# Altium schematic sheet typeCounter.SchDoc
size 594 x 420 mm; SheetNumber: 10; SheetTotal: 11; SPICEModelCacheTYHCYEQT: <root> / <DocumentId>TYHCYEQT</DocumentId> / <CacheFrame Number="0"> / <Model Name="0603_885012206095_100nf" Kind="CKT"> / <Text>******* / .subckt 0603_885012206095_100nF 1 2 / Rser 1 3 0.0157659152881 / Lser 2 4 3.10171966E-10 / C1 3 4 0.0000001 / Rpar 3 4 5000000000 / .ends 0603_885012206095_100nF</Text> / </Model> / <Model Name="0603_885012106006_10uf" Kind="CKT"> / <Text>******* / .subckt 0603_885012106006_10uF 1 2 / Rser 1 3 0.00407641026021 / Lser 2 4 4.16060333E-10 / C1 3 4 0.00001 / Rpar 3 4 5000000 / .ends 0603_885012106006_10uF</Text> / </Model> / </CacheFrame> / </root>
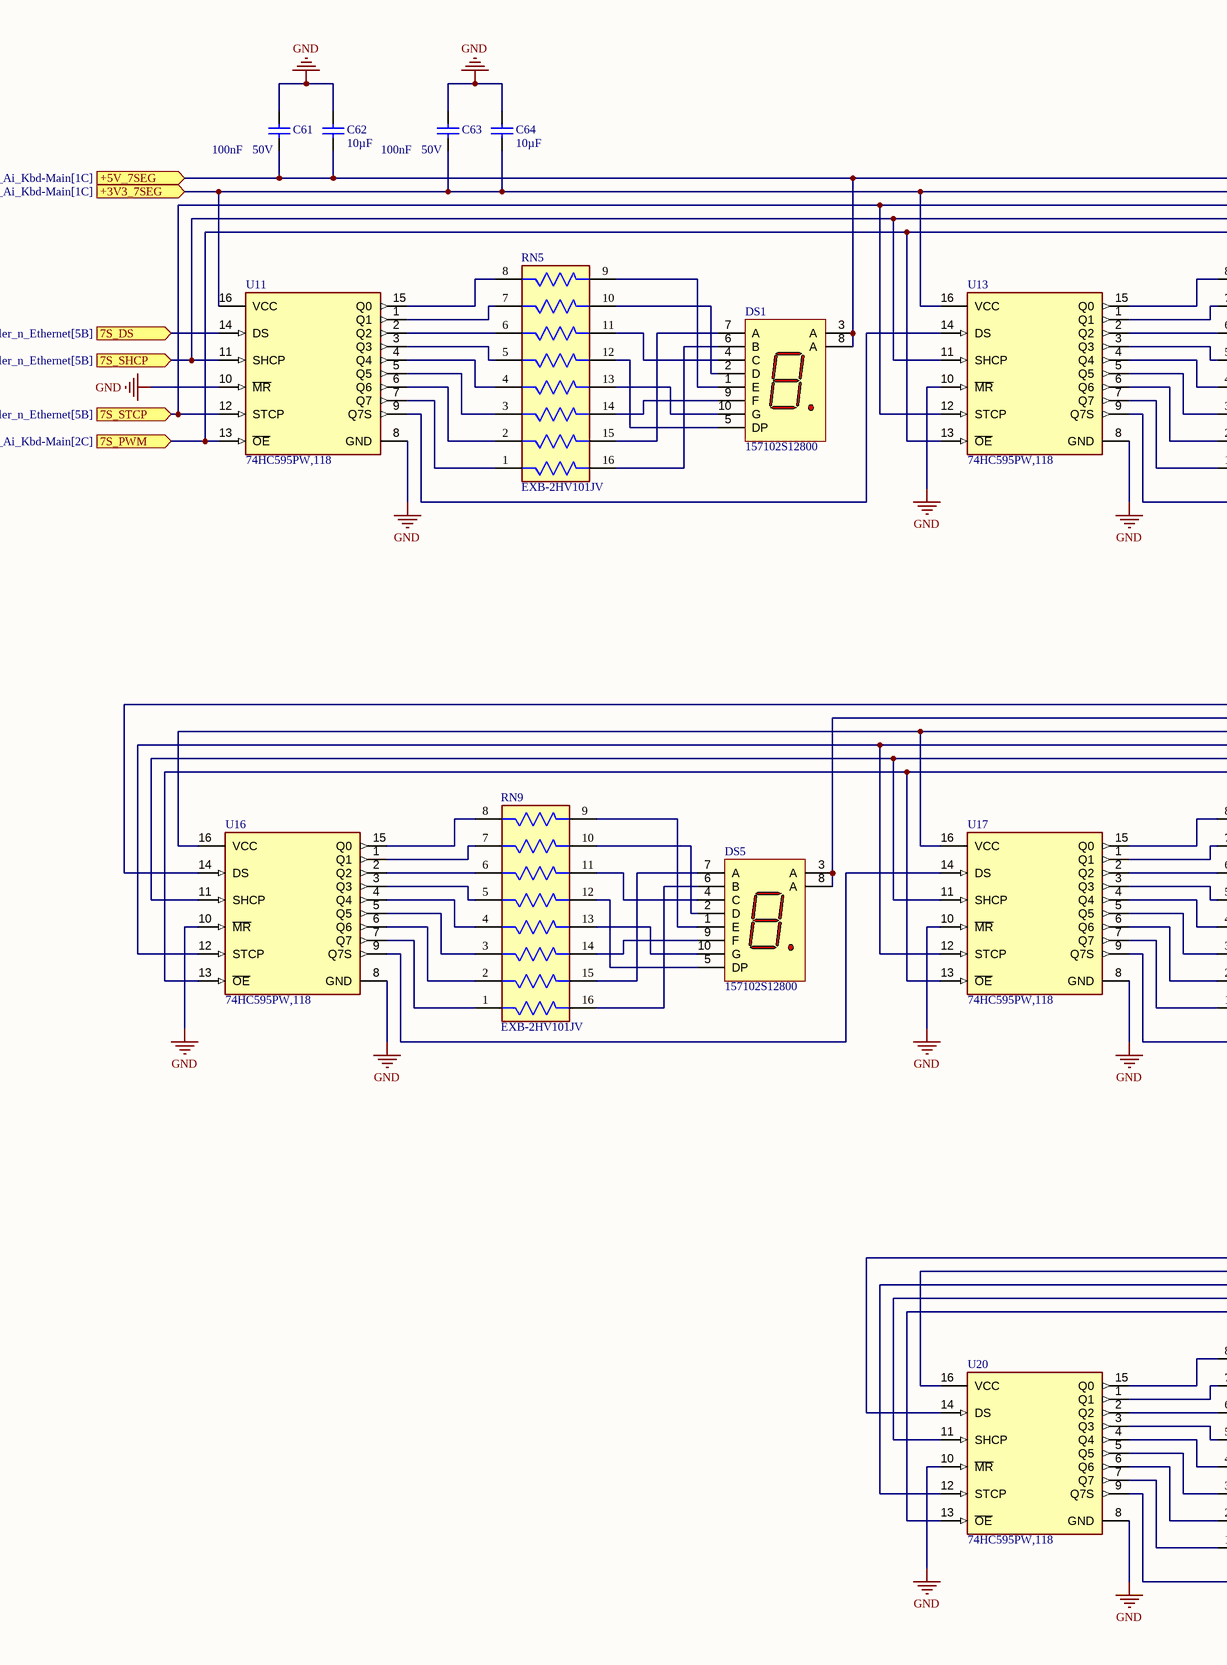
[diagram p0: typeCounter.SchDoc, left]
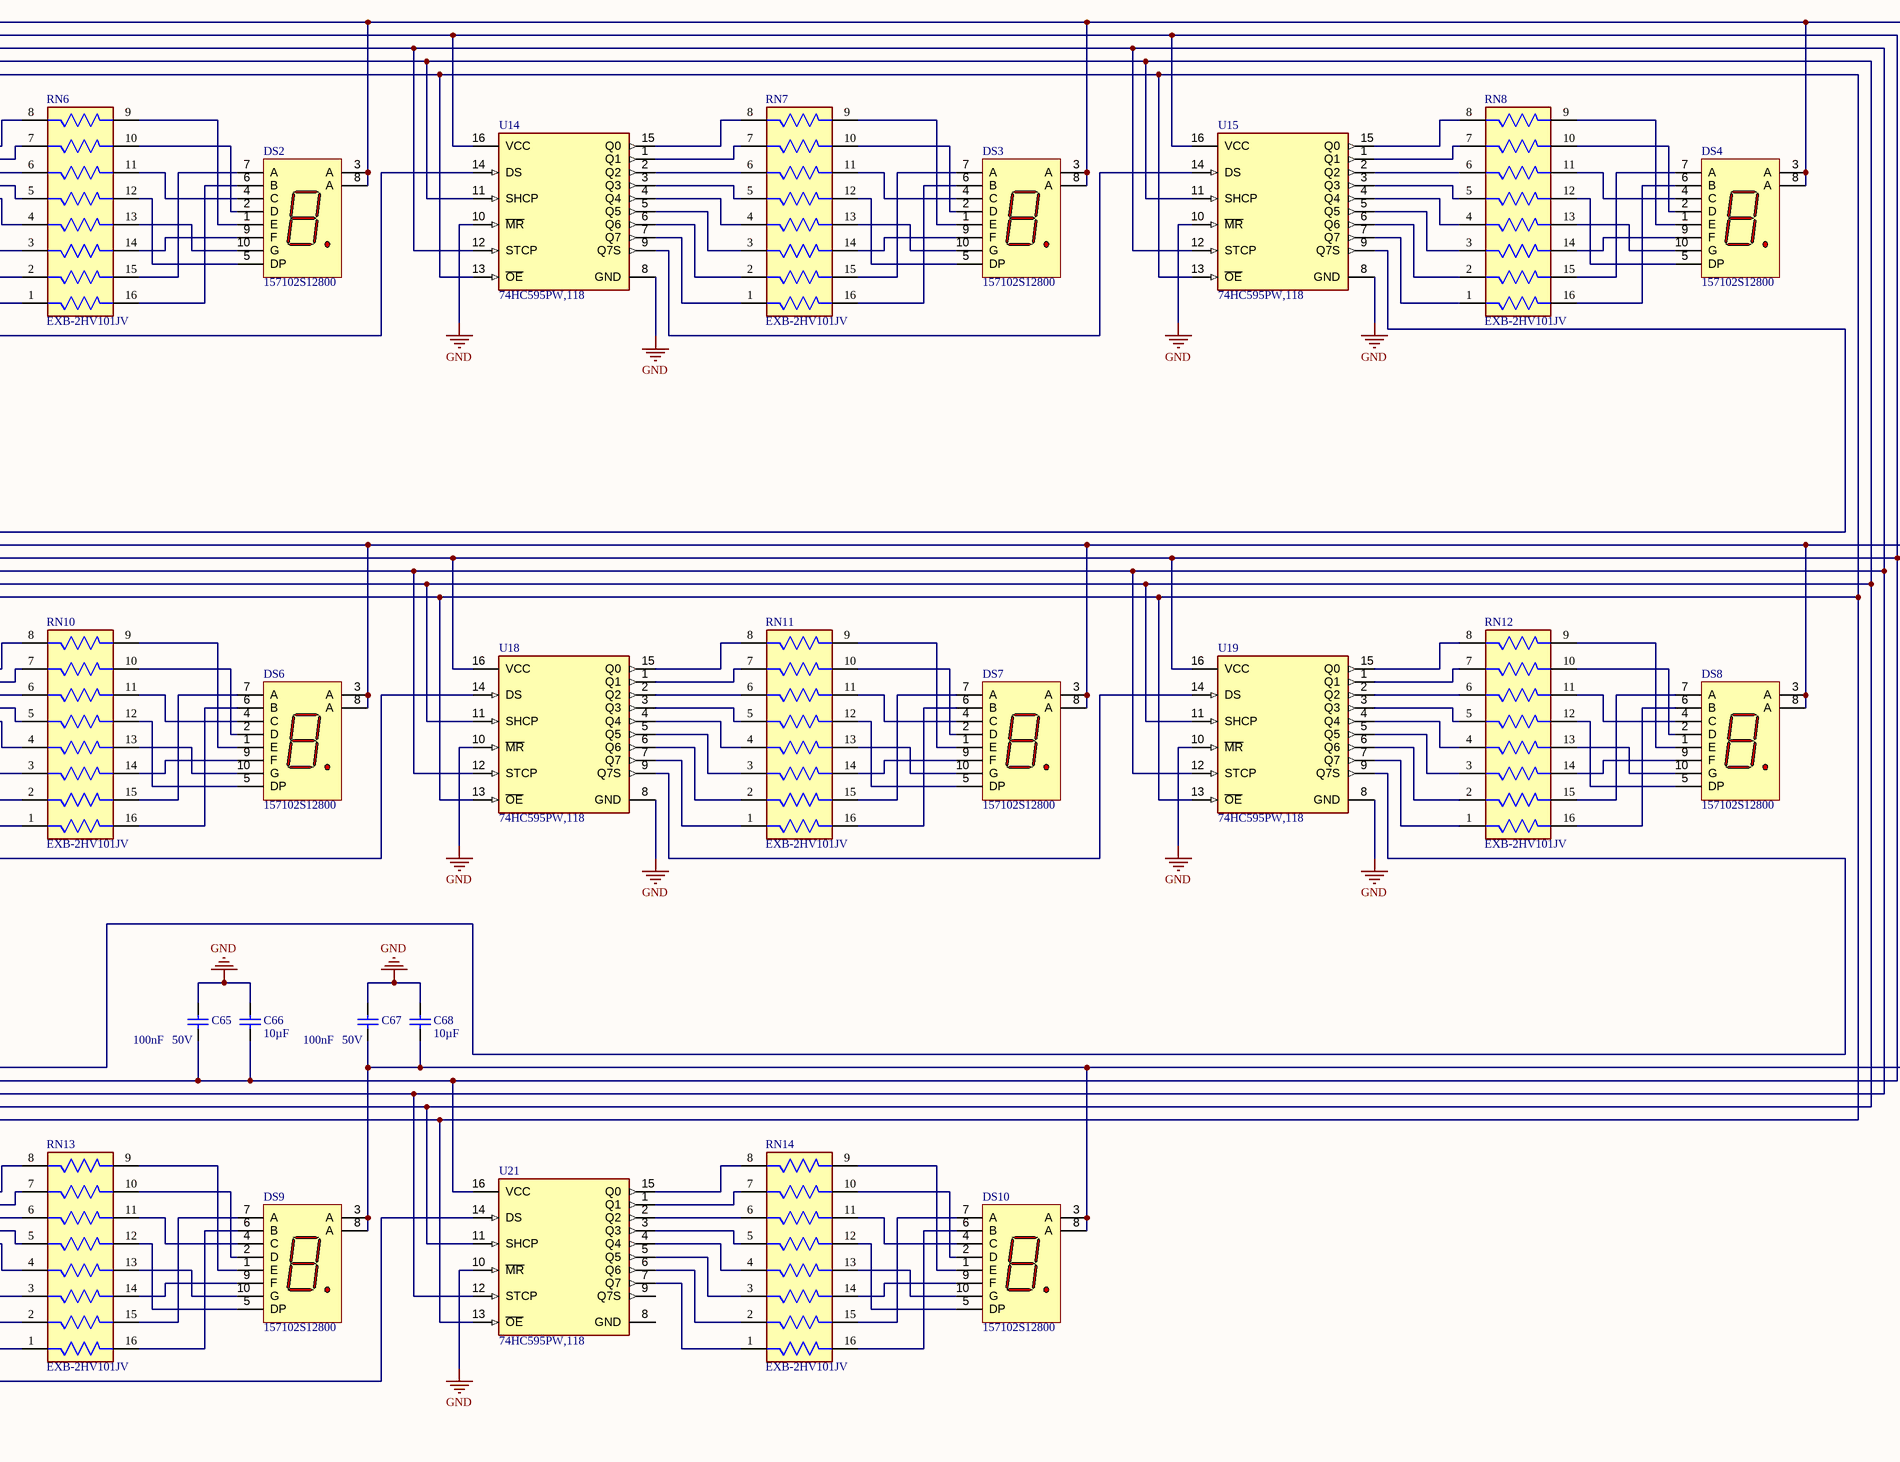
[diagram p1: typeCounter.SchDoc, right]

## Parts
C61  Capacitance: 100nF  Rated Voltage (DC): 50V  [WCAP-CSGP_0603_L1.6W0.8H0.8_Reflow]  (hidden comment: 885012206095)
C62  Capacitance: 10µF  [WCAP-CSGP_0603_L1.6W0.8H0.8_Reflow]  (hidden comment: 885012106006)
C63  Capacitance: 100nF  Rated Voltage (DC): 50V  [WCAP-CSGP_0603_L1.6W0.8H0.8_Reflow]  (hidden comment: 885012206095)
C64  Capacitance: 10µF  [WCAP-CSGP_0603_L1.6W0.8H0.8_Reflow]  (hidden comment: 885012106006)
C65  Capacitance: 100nF  Rated Voltage (DC): 50V  [WCAP-CSGP_0603_L1.6W0.8H0.8_Reflow]  (hidden comment: 885012206095)
C66  Capacitance: 10µF  [WCAP-CSGP_0603_L1.6W0.8H0.8_Reflow]  (hidden comment: 885012106006)
C67  Capacitance: 100nF  Rated Voltage (DC): 50V  [WCAP-CSGP_0603_L1.6W0.8H0.8_Reflow]  (hidden comment: 885012206095)
C68  Capacitance: 10µF  [WCAP-CSGP_0603_L1.6W0.8H0.8_Reflow]  (hidden comment: 885012106006)
DS1  157102S12800  [WL-S7DS_L10W6.9H3]
DS2  157102S12800  [WL-S7DS_L10W6.9H3]
DS3  157102S12800  [WL-S7DS_L10W6.9H3]
DS4  157102S12800  [WL-S7DS_L10W6.9H3]
DS5  157102S12800  [WL-S7DS_L10W6.9H3]
DS6  157102S12800  [WL-S7DS_L10W6.9H3]
DS7  157102S12800  [WL-S7DS_L10W6.9H3]
DS8  157102S12800  [WL-S7DS_L10W6.9H3]
DS9  157102S12800  [WL-S7DS_L10W6.9H3]
DS10  157102S12800  [WL-S7DS_L10W6.9H3]
RN5  EXB-2HV101JV  [FP-EXB2HV-MFG]
RN6  EXB-2HV101JV  [FP-EXB2HV-MFG]
RN7  EXB-2HV101JV  [FP-EXB2HV-MFG]
RN8  EXB-2HV101JV  [FP-EXB2HV-MFG]
RN9  EXB-2HV101JV  [FP-EXB2HV-MFG]
RN10  EXB-2HV101JV  [FP-EXB2HV-MFG]
RN11  EXB-2HV101JV  [FP-EXB2HV-MFG]
RN12  EXB-2HV101JV  [FP-EXB2HV-MFG]
RN13  EXB-2HV101JV  [FP-EXB2HV-MFG]
RN14  EXB-2HV101JV  [FP-EXB2HV-MFG]
U11  74HC595PW,118  [FP-SOT403-1-MFG]
U13  74HC595PW,118  [FP-SOT403-1-MFG]
U14  74HC595PW,118  [FP-SOT403-1-MFG]
U15  74HC595PW,118  [FP-SOT403-1-MFG]
U16  74HC595PW,118  [FP-SOT403-1-MFG]
U17  74HC595PW,118  [FP-SOT403-1-MFG]
U18  74HC595PW,118  [FP-SOT403-1-MFG]
U19  74HC595PW,118  [FP-SOT403-1-MFG]
U20  74HC595PW,118  [FP-SOT403-1-MFG]
U21  74HC595PW,118  [FP-SOT403-1-MFG]

## Ports
7S_DS (in, see Gen_Ai_Kbd-Main[2C], uController_n_Ethernet[5B]), 7S_PWM (in, see Gen_Ai_Kbd-Main[2C]), 7S_SHCP (in, see Gen_Ai_Kbd-Main[2C], uController_n_Ethernet[5B]), 7S_STCP (in, see Gen_Ai_Kbd-Main[2C], uController_n_Ethernet[5B]), +3V3_7SEG (in, see Gen_Ai_Kbd-Main[1C]), +5V_7SEG (in, see Gen_Ai_Kbd-Main[1C])

## Nets
GND: C61.2 C62.2 C63.2 C64.2 C65.2 C66.2 C67.2 C68.2 U11.8(GND) U11.10(~{MR}) U13.8(GND) U13.10(~{MR}) U14.8(GND) U14.10(~{MR}) U15.8(GND) U15.10(~{MR}) U16.8(GND) U16.10(~{MR}) U17.8(GND) U17.10(~{MR}) U18.8(GND) U18.10(~{MR}) U19.8(GND) U19.10(~{MR}) U20.8(GND) U20.10(~{MR}) U21.10(~{MR})
7S_DS: U11.14(DS) ; port 7S_DS
7S_PWM: U11.13(~{OE}) U13.13(~{OE}) U14.13(~{OE}) U15.13(~{OE}) U16.13(~{OE}) U17.13(~{OE}) U18.13(~{OE}) U19.13(~{OE}) U20.13(~{OE}) U21.13(~{OE}) ; port 7S_PWM
7S_SHCP: U11.11(SHCP) U13.11(SHCP) U14.11(SHCP) U15.11(SHCP) U16.11(SHCP) U17.11(SHCP) U18.11(SHCP) U19.11(SHCP) U20.11(SHCP) U21.11(SHCP) ; port 7S_SHCP
7S_STCP: U11.12(STCP) U13.12(STCP) U14.12(STCP) U15.12(STCP) U16.12(STCP) U17.12(STCP) U18.12(STCP) U19.12(STCP) U20.12(STCP) U21.12(STCP) ; port 7S_STCP
+3V3_7SEG: C63.1 C64.1 C65.1 C66.1 U11.16(VCC) U13.16(VCC) U14.16(VCC) U15.16(VCC) U16.16(VCC) U17.16(VCC) U18.16(VCC) U19.16(VCC) U20.16(VCC) U21.16(VCC) ; port +3V3_7SEG
+5V_7SEG: C61.1 C62.1 C67.1 C68.1 DS1.3(A) DS1.8(A) DS2.3(A) DS2.8(A) DS3.3(A) DS3.8(A) DS4.3(A) DS4.8(A) DS5.3(A) DS5.8(A) DS6.3(A) DS6.8(A) DS7.3(A) DS7.8(A) DS8.3(A) DS8.8(A) DS9.3(A) DS9.8(A) DS10.3(A) DS10.8(A) ; port +5V_7SEG
NetDS1_1: DS1.1(E) RN5.9
NetDS1_2: DS1.2(D) RN5.10
NetDS1_4: DS1.4(C) RN5.11
NetDS1_5: DS1.5(DP) RN5.12
NetDS1_6: DS1.6(B) RN5.16
NetDS1_7: DS1.7(A) RN5.15
NetDS1_9: DS1.9(F) RN5.14
NetDS1_10: DS1.10(G) RN5.13
NetDS2_1: DS2.1(E) RN6.9
NetDS2_2: DS2.2(D) RN6.10
NetDS2_4: DS2.4(C) RN6.11
NetDS2_5: DS2.5(DP) RN6.12
NetDS2_6: DS2.6(B) RN6.16
NetDS2_7: DS2.7(A) RN6.15
NetDS2_9: DS2.9(F) RN6.14
NetDS2_10: DS2.10(G) RN6.13
NetDS3_1: DS3.1(E) RN7.9
NetDS3_2: DS3.2(D) RN7.10
NetDS3_4: DS3.4(C) RN7.11
NetDS3_5: DS3.5(DP) RN7.12
NetDS3_6: DS3.6(B) RN7.16
NetDS3_7: DS3.7(A) RN7.15
NetDS3_9: DS3.9(F) RN7.14
NetDS3_10: DS3.10(G) RN7.13
NetDS4_1: DS4.1(E) RN8.9
NetDS4_2: DS4.2(D) RN8.10
NetDS4_4: DS4.4(C) RN8.11
NetDS4_5: DS4.5(DP) RN8.12
NetDS4_6: DS4.6(B) RN8.16
NetDS4_7: DS4.7(A) RN8.15
NetDS4_9: DS4.9(F) RN8.14
NetDS4_10: DS4.10(G) RN8.13
NetDS5_1: DS5.1(E) RN9.9
NetDS5_2: DS5.2(D) RN9.10
NetDS5_4: DS5.4(C) RN9.11
NetDS5_5: DS5.5(DP) RN9.12
NetDS5_6: DS5.6(B) RN9.16
NetDS5_7: DS5.7(A) RN9.15
NetDS5_9: DS5.9(F) RN9.14
NetDS5_10: DS5.10(G) RN9.13
NetDS6_1: DS6.1(E) RN10.9
NetDS6_2: DS6.2(D) RN10.10
NetDS6_4: DS6.4(C) RN10.11
NetDS6_5: DS6.5(DP) RN10.12
NetDS6_6: DS6.6(B) RN10.16
NetDS6_7: DS6.7(A) RN10.15
NetDS6_9: DS6.9(F) RN10.14
NetDS6_10: DS6.10(G) RN10.13
NetDS7_1: DS7.1(E) RN11.9
NetDS7_2: DS7.2(D) RN11.10
NetDS7_4: DS7.4(C) RN11.11
NetDS7_5: DS7.5(DP) RN11.12
NetDS7_6: DS7.6(B) RN11.16
NetDS7_7: DS7.7(A) RN11.15
NetDS7_9: DS7.9(F) RN11.14
NetDS7_10: DS7.10(G) RN11.13
NetDS8_1: DS8.1(E) RN12.9
NetDS8_2: DS8.2(D) RN12.10
NetDS8_4: DS8.4(C) RN12.11
NetDS8_5: DS8.5(DP) RN12.12
NetDS8_6: DS8.6(B) RN12.16
NetDS8_7: DS8.7(A) RN12.15
NetDS8_9: DS8.9(F) RN12.14
NetDS8_10: DS8.10(G) RN12.13
NetDS9_1: DS9.1(E) RN13.9
NetDS9_2: DS9.2(D) RN13.10
NetDS9_4: DS9.4(C) RN13.11
NetDS9_5: DS9.5(DP) RN13.12
NetDS9_6: DS9.6(B) RN13.16
NetDS9_7: DS9.7(A) RN13.15
NetDS9_9: DS9.9(F) RN13.14
NetDS9_10: DS9.10(G) RN13.13
NetDS10_1: DS10.1(E) RN14.9
NetDS10_2: DS10.2(D) RN14.10
NetDS10_4: DS10.4(C) RN14.11
NetDS10_5: DS10.5(DP) RN14.12
NetDS10_6: DS10.6(B) RN14.16
NetDS10_7: DS10.7(A) RN14.15
NetDS10_9: DS10.9(F) RN14.14
NetDS10_10: DS10.10(G) RN14.13
NetRN5_1: RN5.1 U11.7(Q7)
NetRN5_2: RN5.2 U11.6(Q6)
NetRN5_3: RN5.3 U11.5(Q5)
NetRN5_4: RN5.4 U11.4(Q4)
NetRN5_5: RN5.5 U11.3(Q3)
NetRN5_6: RN5.6 U11.2(Q2)
NetRN5_7: RN5.7 U11.1(Q1)
NetRN5_8: RN5.8 U11.15(Q0)
NetRN6_1: RN6.1 U13.7(Q7)
NetRN6_2: RN6.2 U13.6(Q6)
NetRN6_3: RN6.3 U13.5(Q5)
NetRN6_4: RN6.4 U13.4(Q4)
NetRN6_5: RN6.5 U13.3(Q3)
NetRN6_6: RN6.6 U13.2(Q2)
NetRN6_7: RN6.7 U13.1(Q1)
NetRN6_8: RN6.8 U13.15(Q0)
NetRN7_1: RN7.1 U14.7(Q7)
NetRN7_2: RN7.2 U14.6(Q6)
NetRN7_3: RN7.3 U14.5(Q5)
NetRN7_4: RN7.4 U14.4(Q4)
NetRN7_5: RN7.5 U14.3(Q3)
NetRN7_6: RN7.6 U14.2(Q2)
NetRN7_7: RN7.7 U14.1(Q1)
NetRN7_8: RN7.8 U14.15(Q0)
NetRN8_1: RN8.1 U15.7(Q7)
NetRN8_2: RN8.2 U15.6(Q6)
NetRN8_3: RN8.3 U15.5(Q5)
NetRN8_4: RN8.4 U15.4(Q4)
NetRN8_5: RN8.5 U15.3(Q3)
NetRN8_6: RN8.6 U15.2(Q2)
NetRN8_7: RN8.7 U15.1(Q1)
NetRN8_8: RN8.8 U15.15(Q0)
NetRN9_1: RN9.1 U16.7(Q7)
NetRN9_2: RN9.2 U16.6(Q6)
NetRN9_3: RN9.3 U16.5(Q5)
NetRN9_4: RN9.4 U16.4(Q4)
NetRN9_5: RN9.5 U16.3(Q3)
NetRN9_6: RN9.6 U16.2(Q2)
NetRN9_7: RN9.7 U16.1(Q1)
NetRN9_8: RN9.8 U16.15(Q0)
NetRN10_1: RN10.1 U17.7(Q7)
NetRN10_2: RN10.2 U17.6(Q6)
NetRN10_3: RN10.3 U17.5(Q5)
NetRN10_4: RN10.4 U17.4(Q4)
NetRN10_5: RN10.5 U17.3(Q3)
NetRN10_6: RN10.6 U17.2(Q2)
NetRN10_7: RN10.7 U17.1(Q1)
NetRN10_8: RN10.8 U17.15(Q0)
NetRN11_1: RN11.1 U18.7(Q7)
NetRN11_2: RN11.2 U18.6(Q6)
NetRN11_3: RN11.3 U18.5(Q5)
NetRN11_4: RN11.4 U18.4(Q4)
NetRN11_5: RN11.5 U18.3(Q3)
NetRN11_6: RN11.6 U18.2(Q2)
NetRN11_7: RN11.7 U18.1(Q1)
NetRN11_8: RN11.8 U18.15(Q0)
NetRN12_1: RN12.1 U19.7(Q7)
NetRN12_2: RN12.2 U19.6(Q6)
NetRN12_3: RN12.3 U19.5(Q5)
NetRN12_4: RN12.4 U19.4(Q4)
NetRN12_5: RN12.5 U19.3(Q3)
NetRN12_6: RN12.6 U19.2(Q2)
NetRN12_7: RN12.7 U19.1(Q1)
NetRN12_8: RN12.8 U19.15(Q0)
NetRN13_1: RN13.1 U20.7(Q7)
NetRN13_2: RN13.2 U20.6(Q6)
NetRN13_3: RN13.3 U20.5(Q5)
NetRN13_4: RN13.4 U20.4(Q4)
NetRN13_5: RN13.5 U20.3(Q3)
NetRN13_6: RN13.6 U20.2(Q2)
NetRN13_7: RN13.7 U20.1(Q1)
NetRN13_8: RN13.8 U20.15(Q0)
NetRN14_1: RN14.1 U21.7(Q7)
NetRN14_2: RN14.2 U21.6(Q6)
NetRN14_3: RN14.3 U21.5(Q5)
NetRN14_4: RN14.4 U21.4(Q4)
NetRN14_5: RN14.5 U21.3(Q3)
NetRN14_6: RN14.6 U21.2(Q2)
NetRN14_7: RN14.7 U21.1(Q1)
NetRN14_8: RN14.8 U21.15(Q0)
NetU11_9: U11.9(Q7S) U13.14(DS)
NetU13_9: U13.9(Q7S) U14.14(DS)
NetU14_9: U14.9(Q7S) U15.14(DS)
NetU15_9: U15.9(Q7S) U16.14(DS)
NetU16_9: U16.9(Q7S) U17.14(DS)
NetU17_9: U17.9(Q7S) U18.14(DS)
NetU18_9: U18.9(Q7S) U19.14(DS)
NetU19_9: U19.9(Q7S) U20.14(DS)
NetU20_9: U20.9(Q7S) U21.14(DS)

Not connected (* = marked no-connect by the designer): U21 8(GND) 9(Q7S)

## Notes on the sheet
- DWG NO:
- REV:
- REVISION
- DESCRIPTION
- DATE
- APPROVED
- PROJECT
- sumasta
- t
- PROJECT REVISION:
- TITLE
- DOCUMENT REVISION:
- DESIGN ITEM:
- SCALE:
- A2
- SIZE
- CAGE CODE
- FILE NAME
- DWG NO.
- SHEET
- OF
- REV

## Library data of the parts
C61 C63 C65 C67 = CMP-007-000655-1: WCAP-CSGP Multilayer Ceramic Chip Capacitor, General Purpose, size 0603, X7R, 100nF, 50VDC; Manufacturer: Wurth Elektronik; Capacitance Tolerance: +/-10%; Insulation Resistance: 5GO; Case/Size Code: 0603; Technical Reference: X7R0603104K050DFCT10000; Dissipation Factor: 3%; Operating Temperature Max: 125°C; Category: Multilayer Ceramic Chip Capacitors; ComponentLink1Description: Website Link; Manufacturer Part Number: 885012206095; Pin Count: 2; Ceramic Type: X7R; Component Type: Standard; Mount: Surface Mount; Operating Temperature Min: -55°C; Source: WCAP-CSGP.SchLib; ComponentLink2URL: https://www.we-online.com/redexpert/spec/885012206095?ad; Packaging: Tape and Reel; Match Code: WCAP-CSGP; Width: 0.8mm; ComponentLink1URL: https://www.we-online.com/redexpert/article/885012206095?ad; Height: 0.8mm; Design Item ID: 885012206095; Length: 1.6mm; ComponentLink2Description: Datasheet Link
C62 C64 C66 C68 = CMP-007-000403-1: WCAP-CSGP Multilayer Ceramic Chip Capacitor, General Purpose, size 0603, X5R, 10µF, 6.3VDC; Manufacturer: Wurth Elektronik; Rated Voltage (DC): 6.3V; Insulation Resistance: 0.01GO; Technical Reference: X5R0603106M6R3DFCT10000; Dissipation Factor: 10%; Case/Size Code: 0603; Capacitance Tolerance: +/-20%; Mount: Surface Mount; Packaging: Tape and Reel; ComponentLink1URL: https://www.we-online.com/redexpert/article/885012106006?ad; Height: 0.8mm; ComponentLink2URL: https://www.we-online.com/redexpert/spec/885012106006?ad; Category: Multilayer Ceramic Chip Capacitors; Operating Temperature Max: 85°C; Operating Temperature Min: -55°C; Source: WCAP-CSGP.SchLib; Match Code: WCAP-CSGP; Design Item ID: 885012106006; Ceramic Type: X5R; Manufacturer Part Number: 885012106006; Component Type: Standard; Pin Count: 2; Width: 0.8mm; ComponentLink2Description: Datasheet Link; ComponentLink1Description: Website Link; Length: 1.6mm
DS1-DS10 = CMP-03913-133884679-1: 157102S12800 WL-S7DS 7 Segments Display SMT Single Digit; Luminous Intensity: 10mcd; Forward Current: 100mA; Max Reverse Voltage (DC): 5V; Dominant Wavelength: 635nm; Forward Voltage: 2V; RoHS: Compliant; Width: 6.9mm; Max Operating Temperature: 85°C; Length: 10mm; Min Operating Temperature: -35°C; NexarPartId: 133884679; Height: 3mm
RN5-RN14 = CMP-05421-000005-1: RES ARRAY 8 RES 100 OHM 1506; Temperature Coefficient: 200ppm/°C; Number of Contacts: 16; Power Per Element: 62.5mW; Power Rating: 250mW; Resistance Tolerance: 5%; Circuit Type: Isolated; Number of Resistors: 8; Voltage Rating: 25V; Power Dissipation: 63mW; Resistance: 100R; Voltage Rating (DC): 50V; Case/Package: 1506; Depth: 1.6mm; Thickness: 450um; Max Operating Temperature: 125°C; Mount: Surface Mount; Case Code (Imperial): 0402; Min Operating Temperature: -55°C; Termination: Convex; Packaging: Tape and Reel; Number of Terminals/Pins: 16; Technology: THICK FILM; Lead Free: Lead Free; Length: 3.8mm; Size Code: 0402; Tolerance: 5%; Number of Pins: 16; Series: EXB; Height: 0.022inch; Width: 0.063inch; Military Standard: Not; Terminal Pitch: 0.5mm; RoHS Compliant: Yes; Radiation Hardening: No; Case Code (Metric): 1005; REACH SVHC: No SVHC; Contact Plating: Tin; Package Quantity: 1; Number of Elements: 8
U11 U13-U21 = CMP-14351-000004-1: IC SHIFT REGISTER 8BIT 16TSSOP